# Altium schematic sheet Interface.SchDoc: FlightControlBoard-Interface
size A4; SheetNumber: 5; SheetTotal: 5
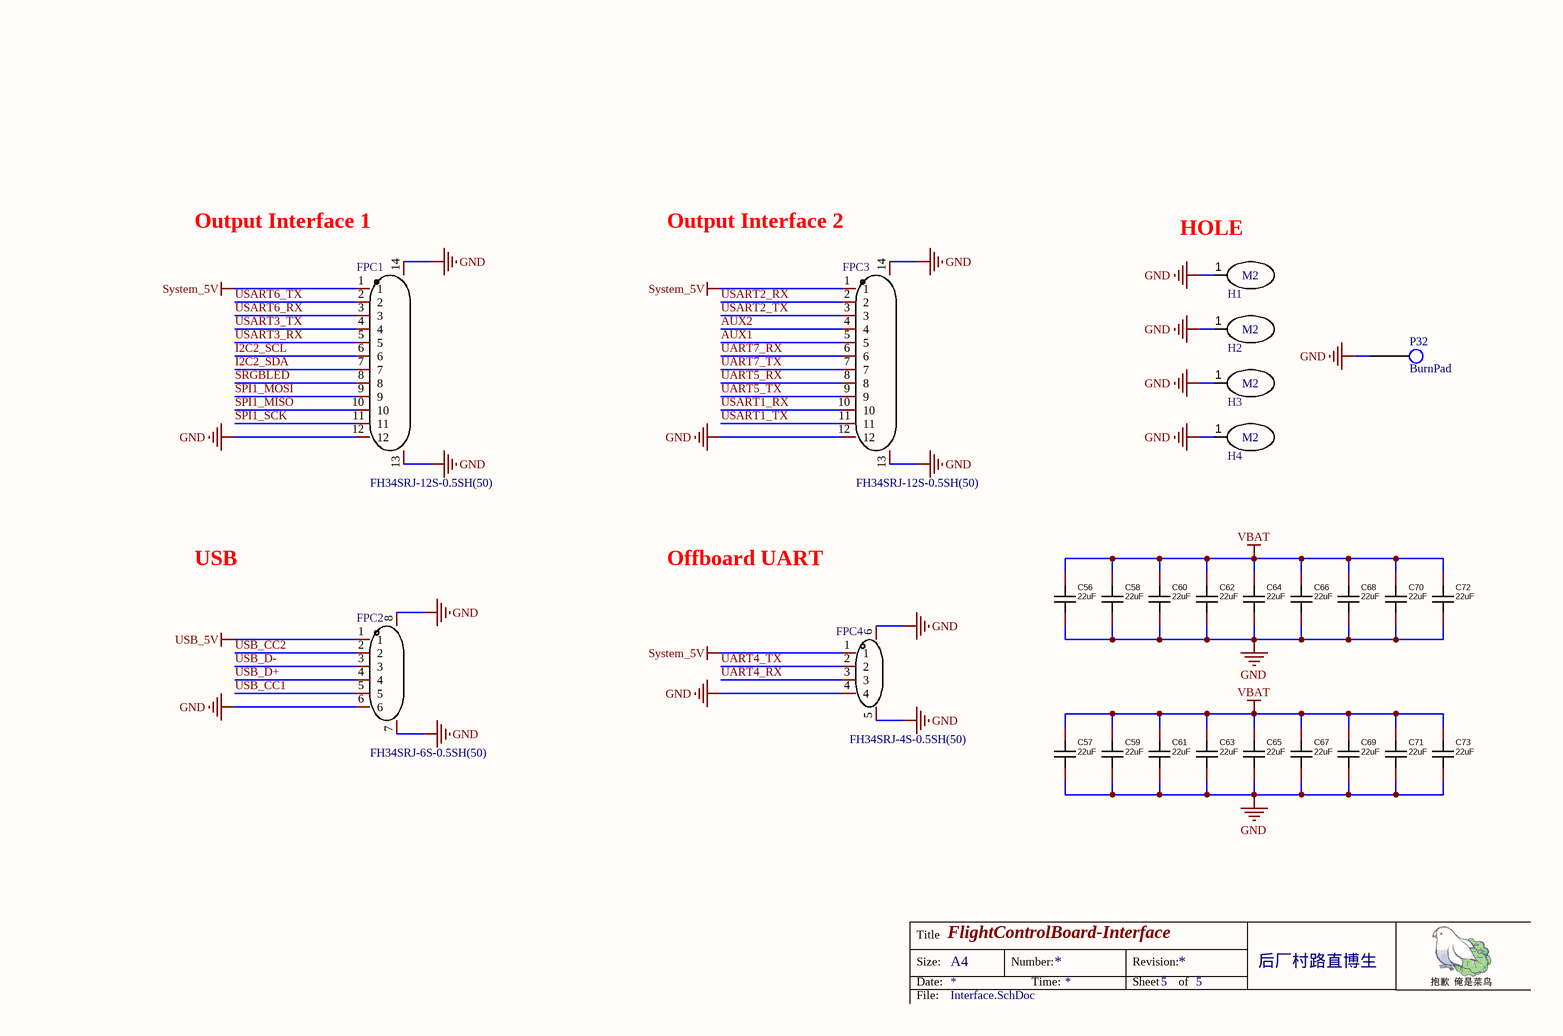
[diagram p0: Interface.SchDoc]

## Parts
C56  22uF  [C0805]
C57  22uF  [C0805]
C58  22uF  [C0805]
C59  22uF  [C0805]
C60  22uF  [C0805]
C61  22uF  [C0805]
C62  22uF  [C0805]
C63  22uF  [C0805]
C64  22uF  [C0805]
C65  22uF  [C0805]
C66  22uF  [C0805]
C67  22uF  [C0805]
C68  22uF  [C0805]
C69  22uF  [C0805]
C70  22uF  [C0805]
C71  22uF  [C0805]
C72  22uF  [C0805]
C73  22uF  [C0805]
FPC1  FH34SRJ-12S-0.5SH(50)  [FFC-SMD_12P-P0.50_FH34SRJ-12S-0.5SH]
FPC2  FH34SRJ-6S-0.5SH(50)  [FFC-SMD_6P-P0.50_FH34SRJ-6S-0.5SH]
FPC3  FH34SRJ-12S-0.5SH(50)  [FFC-SMD_12P-P0.50_FH34SRJ-12S-0.5SH]
FPC4  FH34SRJ-4S-0.5SH(50)  [FFC-SMD_4P-P0.50_FH34SRJ-4S-0.5SH]
H1  M2_HOLE  [M2_HOLE]  (value not drawn)
H2  M2_HOLE  [M2_HOLE]  (value not drawn)
H3  M2_HOLE  [M2_HOLE]  (value not drawn)
H4  M2_HOLE  [M2_HOLE]  (value not drawn)
P32  BurnPad  [BurnPad_0.5mm]

## Nets
GND: C56.2 C57.2 C58.2 C59.2 C60.2 C61.2 C62.2 C63.2 C64.2 C65.2 C66.2 C67.2 C68.2 C69.2 C70.2 C71.2 C72.2 C73.2 FPC1.12 FPC1.13 FPC1.14 FPC2.6 FPC2.7 FPC2.8 FPC3.12 FPC3.13 FPC3.14 FPC4.4 FPC4.5 FPC4.6 H1.1 H2.1 H3.1 H4.1 P32.1
System_5V: FPC1.1 FPC3.1 FPC4.1
USB_5V: FPC2.1
VBAT: C56.1 C57.1 C58.1 C59.1 C60.1 C61.1 C62.1 C63.1 C64.1 C65.1 C66.1 C67.1 C68.1 C69.1 C70.1 C71.1 C72.1 C73.1
AUX1: FPC3.5
AUX2: FPC3.4
I2C2_SCL: FPC1.6
I2C2_SDA: FPC1.7
SPI1_MISO: FPC1.10
SPI1_MOSI: FPC1.9
SPI1_SCK: FPC1.11
SRGBLED: FPC1.8
UART4_RX: FPC4.3
UART4_TX: FPC4.2
UART5_RX: FPC3.8
UART5_TX: FPC3.9
UART7_RX: FPC3.6
UART7_TX: FPC3.7
USART1_RX: FPC3.10
USART1_TX: FPC3.11
USART2_RX: FPC3.2
USART2_TX: FPC3.3
USART3_RX: FPC1.5
USART3_TX: FPC1.4
USART6_RX: FPC1.3
USART6_TX: FPC1.2
USB_CC1: FPC2.5
USB_CC2: FPC2.2
USB_D+: FPC2.4
USB_D-: FPC2.3

## Notes on the sheet
- (near FPC1) Output Interface 1
- (near FPC3) Output Interface 2
- (near H1) HOLE
- USB
- Offboard UART
- Title
- Size:
- Date:
- A4
- Number:
- Time:
- Revision:
- Sheet
- of
- 后厂村路直博生
- File:
- (in symbol M2_HOLE) M2

## Library data of the parts
C56-C73 = CC0603KRX7R9BB104: Add into BOM: yes; Convert to PCB: yes; Value: 22uF
FPC1 FPC3 = FH34SRJ-12S-0.5SH(50): Manufacturer: HRS(广濑); Add into BOM: yes; Number of Contacts: 12P; Pitch: 0.5mm; FFC, FCB Thickness: 0.3mm; Symbol: FH34SRJ-12S-0.5SH(50); Device: FH34SRJ-12S-0.5SH(50); Supplier: LCSC; Supplier Part: C424659; Manufacturer Part: FH34SRJ-12S-0.5SH(50); JLCPCB Part Class: Extended Part; LCSC Part Name: 间距:0.5mm P数:12P 双侧触点/上下接; Supplier Footprint: SMD,P=0.5mm,卧贴; Datasheet: https://atta.szlcsc.com/upload/public/pdf/source/20190903/C424660_13F2CCC518A089E10A5EDDF0ACBC803F.pdf; Convert to PCB: yes; Locking Feature: -; Contact Type: 双侧触点/上下接; Mounting Type: 卧贴; Height Above Board: 1mm; Contact Material: 磷青铜; Contact Plating: 金; Operating Temperature Range: -55℃~+105℃
FPC2 = FH34SRJ-6S-0.5SH(50): Manufacturer: HRS(广濑); Add into BOM: yes; Number of Contacts: 6P; Pitch: 0.5mm; FFC, FCB Thickness: 0.3mm; Symbol: FH34SRJ-6S-0.5SH(50); Device: FH34SRJ-6S-0.5SH(50); Supplier: LCSC; Supplier Part: C224194; Manufacturer Part: FH34SRJ-6S-0.5SH(50); JLCPCB Part Class: Extended Part; LCSC Part Name: 间距:0.5mm P数:6P 双侧触点/上下接; Supplier Footprint: SMD,P=0.5mm,卧贴; Datasheet: https://atta.szlcsc.com/upload/public/pdf/source/20180712/C224194_08937A353F43080B85824A8384727686.pdf; Convert to PCB: yes; Locking Feature: -; Contact Type: 双侧触点/上下接; Mounting Type: 卧贴; Height Above Board: 1mm; Contact Material: 磷青铜; Contact Plating: 金; Operating Temperature Range: -55℃~+105℃; Soldering Temperature(Max): -
FPC4 = FH34SRJ-4S-0.5SH(50): Manufacturer: HRS(广濑); Add into BOM: yes; Number of Contacts: 4P; Pitch: 0.5mm; FFC, FCB Thickness: 0.3mm; Symbol: FH34SRJ-4S-0.5SH(50); Device: FH34SRJ-4S-0.5SH(50); Supplier: LCSC; Supplier Part: C596732; Manufacturer Part: FH34SRJ-4S-0.5SH(50); JLCPCB Part Class: Extended Part; LCSC Part Name: 间距:0.5mm P数:4P 双侧触点/上下接; Supplier Footprint: SMD,P=0.5mm,卧贴; Datasheet: https://atta.szlcsc.com/upload/public/pdf/source/20210303/C596732_A8DFF1AAA7954D31ED084C13292B0B28.pdf; Convert to PCB: yes; Locking Feature: -; Contact Type: 双侧触点/上下接; Mounting Type: 卧贴; Height Above Board: 1mm; Contact Material: 磷青铜; Contact Plating: 金; Operating Temperature Range: -55℃~+105℃; Soldering Temperature(Max): -